# EAGLE design WYM12864_Adapter - MARKS (EAGLE 9.6.2)
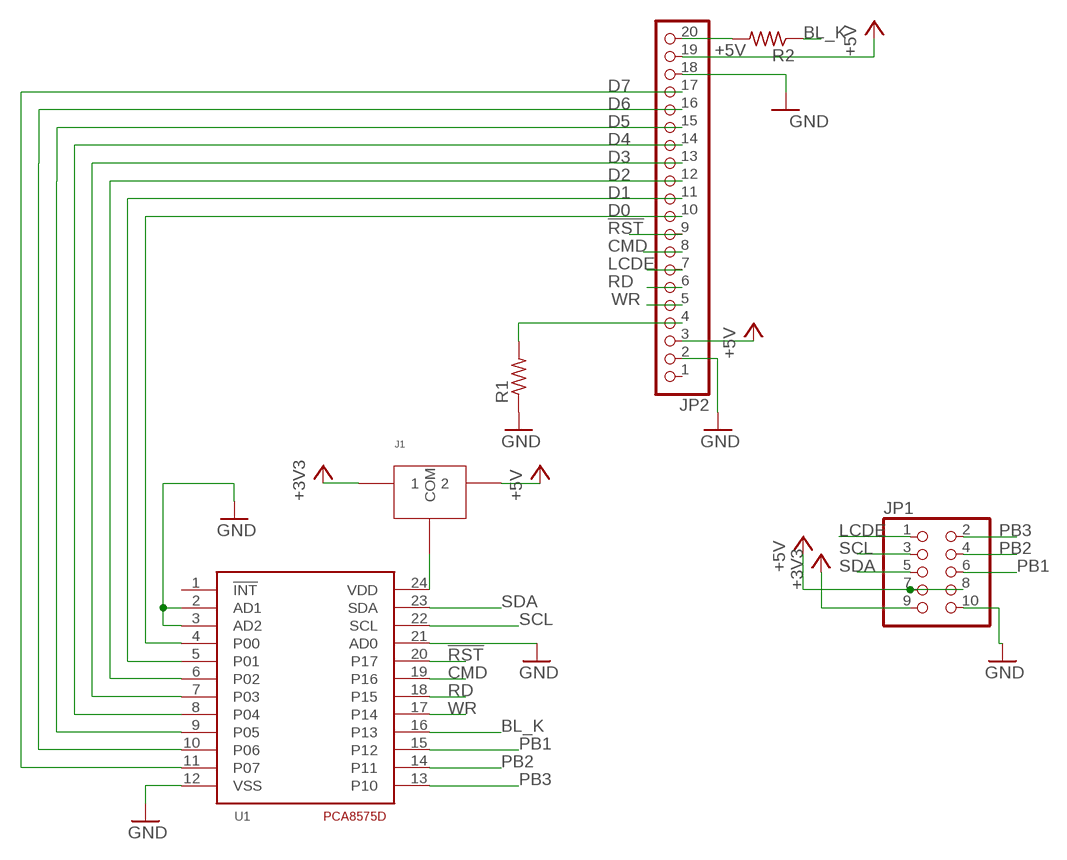
[diagram p0: schematic, sheet 1]

## Parts
J1  JMP_3WAY  [JUMPER_THREEWAY]
JP1  PINHD-2X5  [2X05]
JP2  PINHD-1X20  [1X20]
R1  R-US_M0805  [M0805]
R2  R-US_M0805  [M0805]
U1  PCA8575DSOIC-24  [SOIC-24]

## Nets
!RST: JP2.9 U1.20(P17)
+3V3: J1.1 JP1.9
+5V: J1.2 JP1.7 JP1.8 JP2.3 JP2.19
BL_K: R2.1 U1.16(P13)
CMD: JP2.8 U1.19(P16)
D0: JP2.10 U1.4(P00)
D1: JP2.11 U1.5(P01)
D2: JP2.12 U1.6(P02)
D3: JP2.13 U1.7(P03)
D4: JP2.14 U1.8(P04)
D5: JP2.15 U1.9(P05)
D6: JP2.16 U1.10(P06)
D7: JP2.17 U1.11(P07)
GND: JP1.10 JP2.2 JP2.18 R1.1 U1.2(AD1) U1.3(AD2) U1.12(VSS) U1.21(AD0)
LCDE: JP1.1 JP2.7
N$2: JP2.4 R1.2
N$3: J1.C(COM) U1.24(VDD)
N$7: JP2.20 R2.2
PB1: JP1.6 U1.15(P12)
PB2: JP1.4 U1.14(P11)
PB3: JP1.2 U1.13(P10)
RD: JP2.6 U1.18(P15)
SCL: JP1.3 U1.22(SCL)
SDA: JP1.5 U1.23(SDA)
WR: JP2.5 U1.17(P14)
Unconnected: JP2.1 U1.1(!INT)

## Library data of the parts
J1 = DR:JMP_3WAY
JP1 = pinhead:PINHD-2X5: PIN HEADER
JP2 = pinhead:PINHD-1X20: PIN HEADER
R1 R2 = DR:R-US_: RESISTOR, American symbol
U1 = DR:PCA8575D: I2C IO Expander Input/Output

## Board
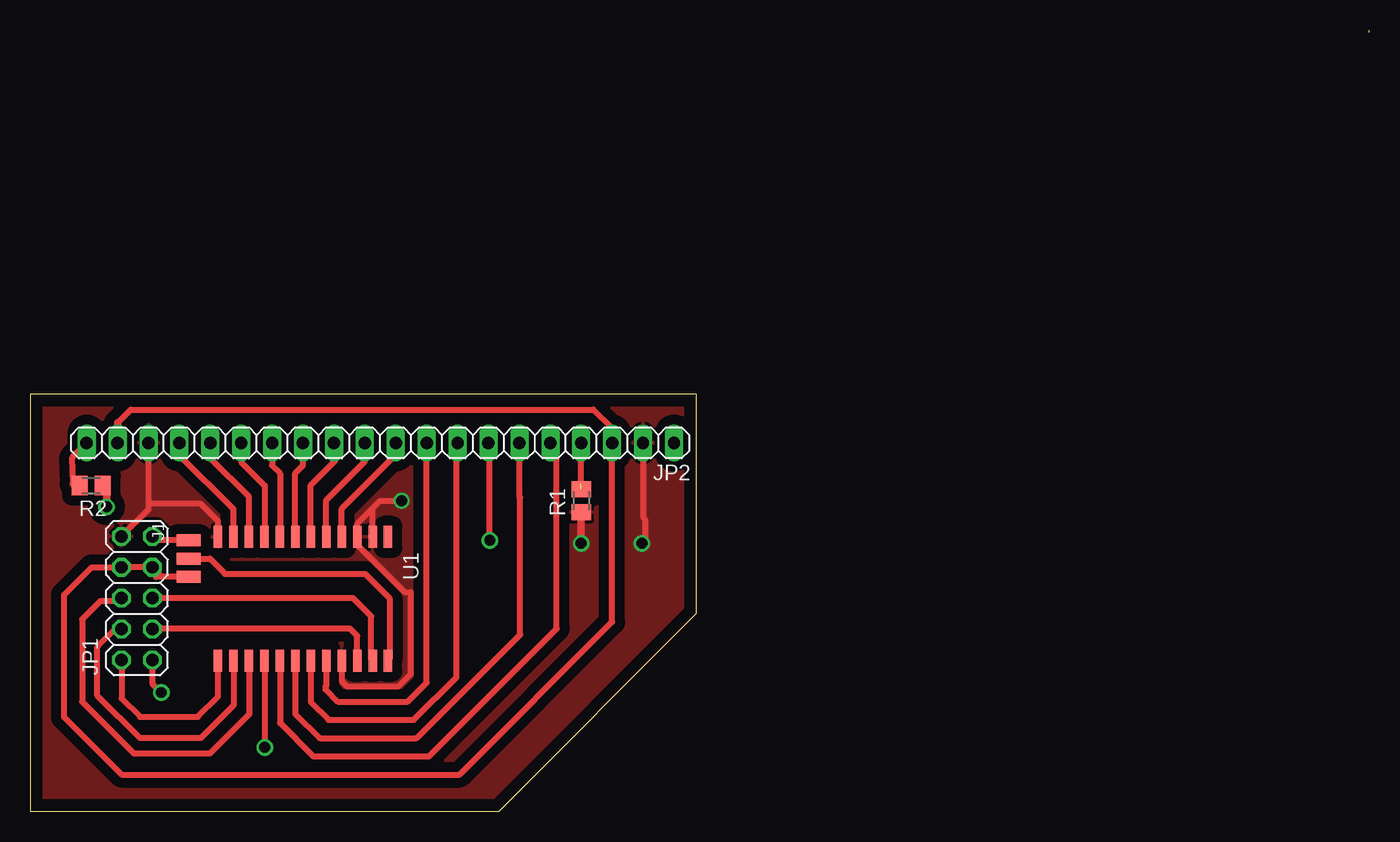
[diagram p1: board, top side]
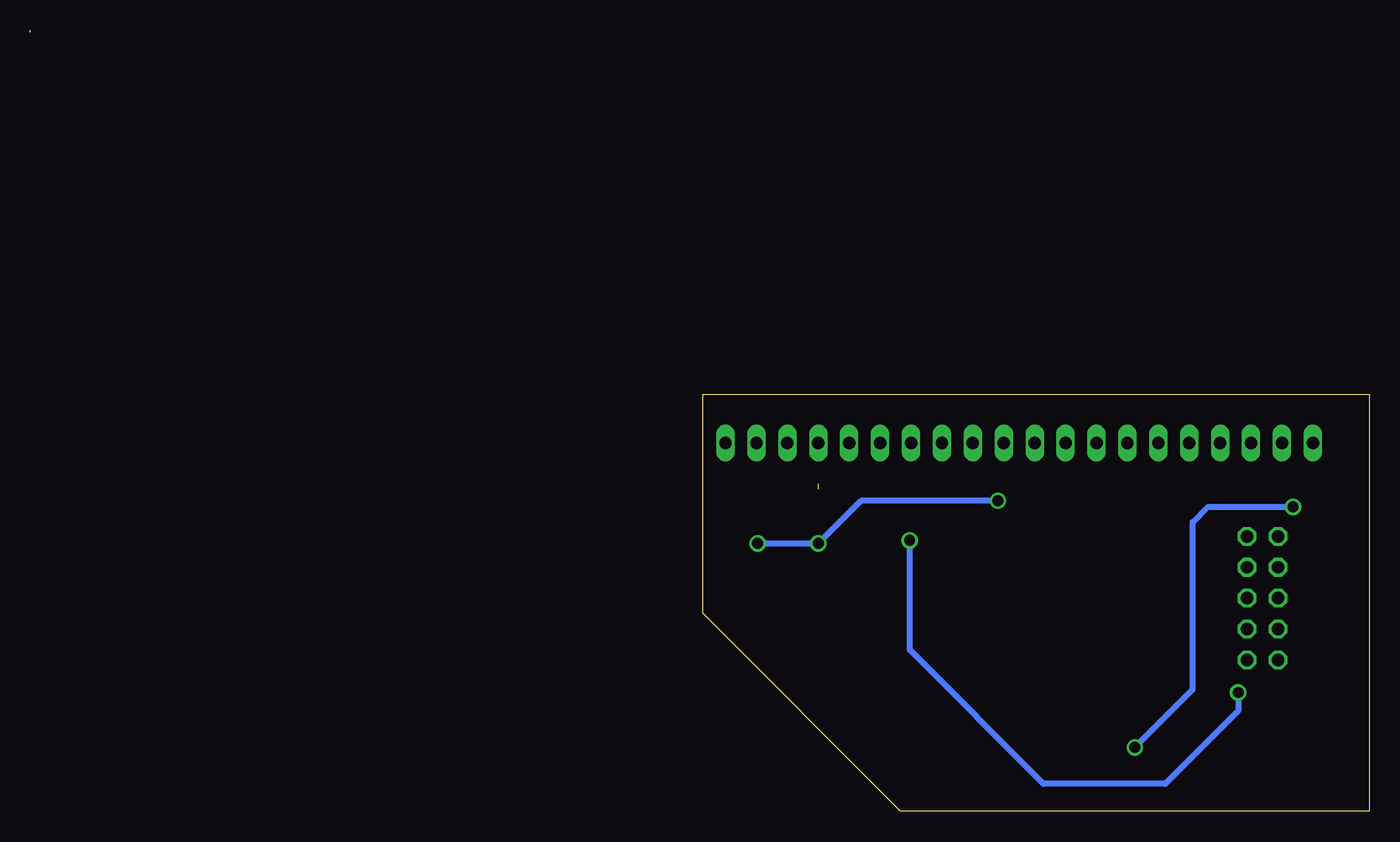
[diagram p2: board, bottom side, seen from below]

Size 110 x 64.14 mm. Coordinates in mm from the lower left corner, seen from the top.
Outline: 110,64 110,64.14
Outline: 0,34.25 0,0 38.5,0 54.75,16.25 54.75,34.25 0,34.25
Copper layers (1*16): Top 0.035mm / dielectric 1.5mm / Bottom 0.035mm
Design rules "default": minimum track width 10mil, minimum drill 24mil, track to track 8mil, track to pad 8mil, pad to pad 8mil, via to via 8mil, smd to smd 8mil, copper to edge 40mil, drill to drill 8mil, minimum pad ring 10mil, minimum via ring 8mil, stop-mask expansion 4mil, vias tented up to drill 0mil, thermal gap 10mil

### Footprints (pad centres in the part's own frame; a part is rotated, then mirrored left to right if it is on the bottom)
JUMPER_THREEWAY = smd 1 x 2: 1 -1.5,0; 2 1.5,0; C 0,0
2X05 = drill 1.016 octagon: 1 -5.08,-1.27; 2 -5.08,1.27; 3 -2.54,-1.27; 4 -2.54,1.27; 5 0,-1.27; 6 0,1.27; 7 2.54,-1.27; 8 2.54,1.27; 9 5.08,-1.27; 10 5.08,1.27
1X20 = drill 1.016 long: 1 -24.13,0; 2 -21.59,0; 3 -19.05,0; 4 -16.51,0; 5 -13.97,0; 6 -11.43,0; 7 -8.89,0; 8 -6.35,0; 9 -3.81,0; 10 -1.27,0; 11 1.27,0; 12 3.81,0; 13 6.35,0; 14 8.89,0; 15 11.43,0; 16 13.97,0; 17 16.51,0; 18 19.05,0; 19 21.59,0; 20 24.13,0
M0805 = smd 1.3 x 1.6: 1 -0.95,0; 2 0.95,0
SOIC-24 = smd 1.8 x 0.7: 1 0,0; 2 0,-1.27; 3 0,-2.54; 4 0,-3.81; 5 0,-5.08; 6 0,-6.35; 7 0,-7.62; 8 0,-8.89; 9 0,-10.16; 10 0,-11.43; 11 0,-12.7; 12 0,-13.97; 13 10.16,-13.97; 14 10.16,-12.7; 15 10.16,-11.43; 16 10.16,-10.16; 17 10.16,-8.89; 18 10.16,-7.62; 19 10.16,-6.35; 20 10.16,-5.08; 21 10.16,-3.81; 22 10.16,-2.54; 23 10.16,-1.27; 24 10.16,0

### Placement (x,y rotation side)
J1  13,20.75 270 top
JP1  8.75,17.5 90 top
JP2  28.75,30.25 180 top
R1  45.25,25.5 90 top
R2  5,26.75 180 top
U1  29.39,22.53 270 top

### Tracks (layer width: path | path; a pad name or v marks a point on that pad's centre or on a via)
!RST
  Top 0.508: U1.20 24.31,10.31 24.25,10.25 24.25,10 25.25,9 31,9 32.56,10.56 JP2.9
+3V3
  Top 0.508: JP1.9 10.35,22.25 J1.1
+5V
  Top 0.508: 47.75,30.2 JP2.3 | J1.2 10.75,19.25 | 10.75,19.25 10.32,19.25 | 10.75,19.25 10.75,19.31 JP1.7 JP1.8 7.44,20 5,20 2.75,17.75 2.75,7.75 7.5,3 35.25,3 47.8,15.55 JP2.3 | 7.16,31.89 8.25,32.98 46.25,32.98 47.75,31.48 47.75,30.3 JP2.3
  Top 0.61: 7.16,31.89 JP2.19
BL_K  (via drill 0.9 pad 1.2)
  Top 0.508: U1.16 19.23,5.52 19.25,5.5 v19.25,5.25 | v6.25,25 6.31,25 6.31,26.89
  Top 0.61: R2.1 6.25,26.45 v6.25,25
  Bottom 0.508: v19.25,5.25 14.5,10 14.5,23.75 13.25,25 v6.25,25
CMD
  Top 0.508: JP2.8 35,30.15 35,11 31.5,7.5 24.5,7.5 23.04,8.96 U1.19
D0
  Top 0.508: U1.4 25.58,24.83 30.02,29.27 JP2.10
D1
  Top 0.508: U1.5 24.31,25.56 27.5,28.75 27.5,30.23 JP2.11
D2
  Top 0.508: U1.6 23.04,26.79 25,28.75 25,30.19 JP2.12
D3
  Top 0.508: U1.7 21.77,27.77 22.4,28.4 JP2.13
D4
  Top 0.508: JP2.14 19.86,28.39 20.5,27.75 U1.8
D5
  Top 0.508: JP2.15 17.32,28.68 19.25,26.75 19.25,22.55 U1.9
D6
  Top 0.508: JP2.16 14.78,29 17.96,25.82 U1.10
D7
  Top 0.508: U1.11 16.69,24.81 12.24,29.26 JP2.17
GND  (via drill 0.9 pad 1.2)
  Top 0.508: U1.2 28.12,24.87 | 28.12,24.87 28.75,25.5 v30.5,25.5 | 45,21.75 45.12,21.62 | JP2.2 50.34,24.16 50.5,24 50.5,22.25 v50.25,22 | 28.12,24.87 26.85,23.6 U1.3 26.85,21.9 30.75,18 31.25,18 31.25,11.25 30.25,10.25 26,10.25 25.58,10.67 U1.21 | JP1.10 9.7,24.8 9.7,25.25 | 9.7,25.25 JP2.18 | U1.12 15.42,23.83 14,25.25 9.7,25.25
  Top 0.61: 45.25,24.1 v45.25,22 45,21.75
  Bottom 0.508: v30.5,25.5 41.75,25.5 v45.25,22 v50.25,22
  pour Top (isolate 0.813): -1.75,35.94 55.99,35.94 55.99,-0.94 -1.75,-1.47
LCDE  (via drill 0.9 pad 1.2)
  Top 0.508: JP2.7 37.73,30.16 37.73,22.27 v37.75,22.25 | JP1.1 10.02,10.48 v10.75,9.75
  Bottom 0.508: v10.75,9.75 10.75,8.25 16.75,2.25 26.75,2.25 37.75,13.25 v37.75,22.25
N$2  (1 unrouted)
  Top 0.508: 45.25,26.9 JP2.4
N$3
  Top 0.508: J1.C 14.75,20.75 16,19.5 27.5,19.5 29.5,17.5 29.5,12.48 U1.24
N$7
  Top 0.508: 3.51,26.89 3.44,29.07 JP2.20
  Top 0.61: R2.2 3.65,26.75 3.51,26.89
PB1
  Top 0.508: JP1.6 7.23,17.25 5.75,17.25 4.25,15.75 4.25,9 8.5,4.75 14.75,4.75 18,8 18,12.33 U1.15
PB2
  Top 0.508: U1.14 16.69,8.69 14,6 9,6 5.5,9.5 5.5,13.5 6.96,14.96 JP1.4
PB3
  Top 0.508: JP1.2 7.5,12.4 7.5,9.25 9,7.75 13.75,7.75 15.42,9.42 U1.13
RD
  Top 0.508: JP2.6 40.18,25.82 40.25,25.75 40.25,14.5 31.75,6 23.75,6 21.77,7.98 U1.18
SCL
  Top 0.508: U1.22 26.85,14.4 26.25,15 10.06,15 JP1.3
SDA
  Top 0.508: U1.23 28,12.49 28,16 26.5,17.5 JP1.5
WR
  Top 0.508: JP2.5 43.25,29.72 43.25,15 32.75,4.5 23.25,4.5 20.5,7.25 U1.17